# Altium schematic sheet DAC & MIC.SchDoc: Mixed Signal Design PCB
size A4; DocumentNumber: 11; Revision: A; SheetNumber: 11; SheetTotal: 11
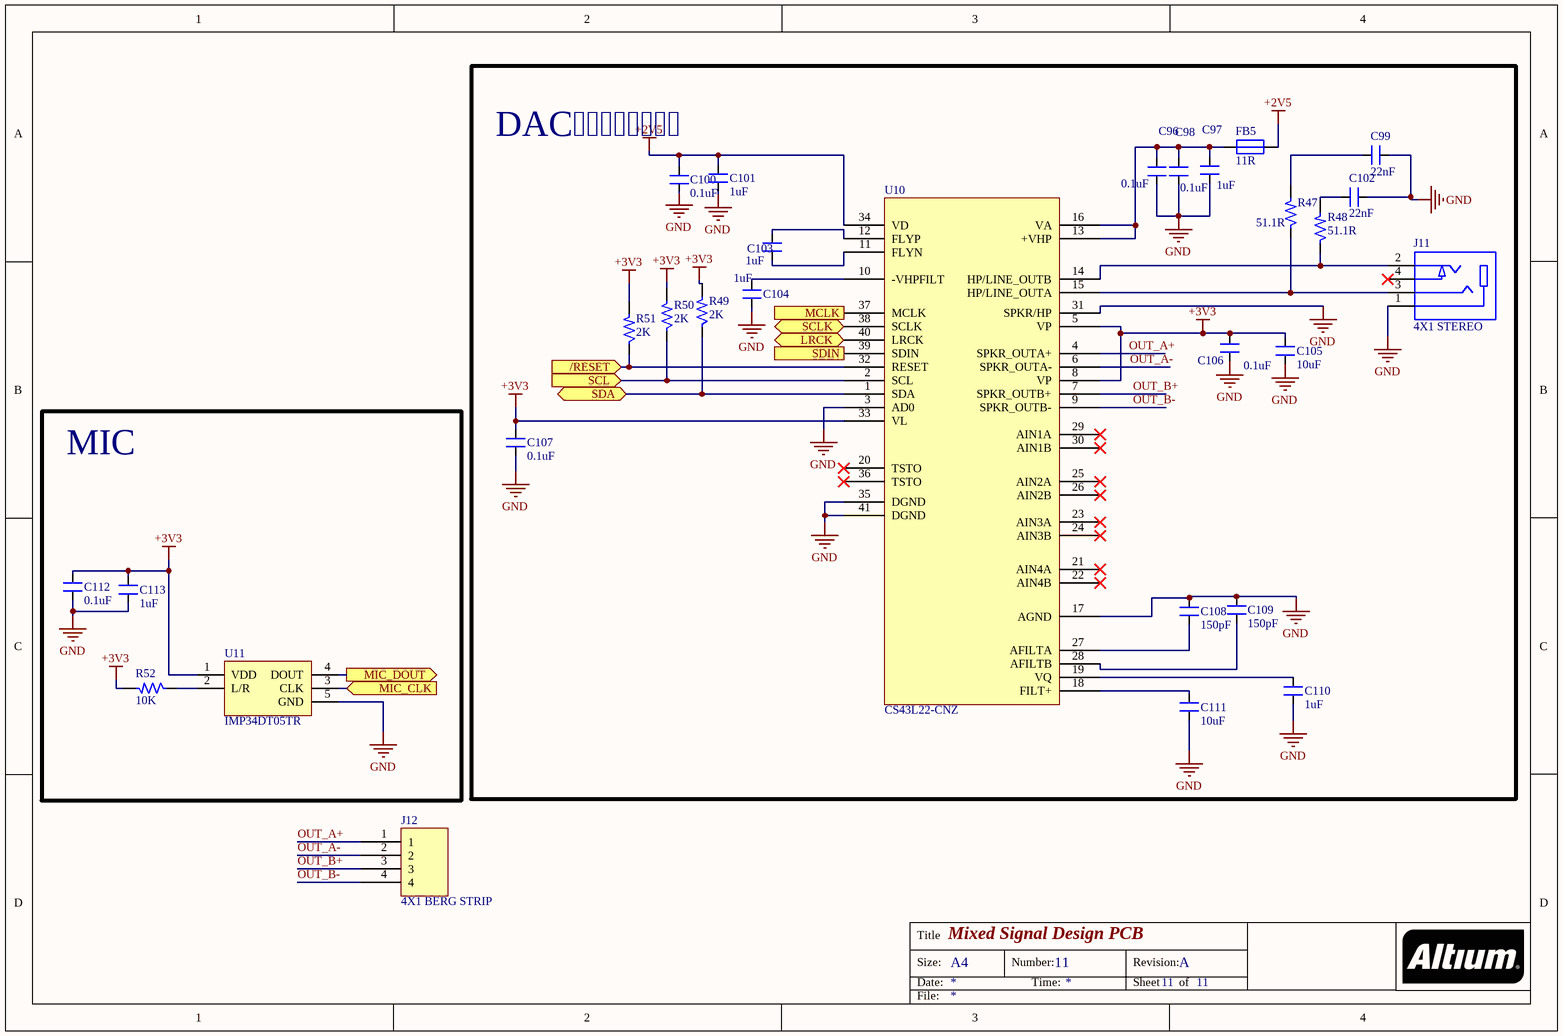
[diagram p0: DAC & MIC.SchDoc]

## Parts
C96  0.1uF  [CAP_0805]
C97  1uF  [CAP_0805]
C98  0.1uF  [CAP_0805]
C99  22nF  [CAP_0805]
C100  0.1uF  [CAP_0805]
C101  1uF  [CAP_0805]
C102  22nF  [CAP_0805]
C103  1uF  [CAP_0805]
C104  1uF  [CAP_0805]
C105  10uF  [CAP_1206]
C106  0.1uF  [CAP_0805]
C107  0.1uF  [CAP_0805]
C108  150pF  [CAP_0805]
C109  150pF  [CAP_0805]
C110  1uF  [CAP_0805]
C111  10uF  [CAP_1206]
C112  0.1uF  [CAP_0805]
C113  1uF  [CAP_0805]
FB5  11R  [IND_0805]
J11  4X1 STEREO  [CON_SJ-2504A-SMT-TR_SMD]
J12  4X1 BERG STRIP  [CON4_100_40D72_TH_ST_MALE]
R47  51.1R  [RES_0603]
R48  51.1R  [RES_0603]
R49  2K  [RES_0805]
R50  2K  [RES_0805]
R51  2K  [RES_0805]
R52  10K  [RES_0805]
U10  CS43L22-CNZ  [QFN40_19_284_33X9_SMD]
U11  IMP34DT05TR  [HCLGA-4_53_137_15X37_SMD]

## Blocks framed on the sheet
DAC: C96-C111 FB5 J11 R47-R51 U10
MIC: C112 C113 R52 U11

## Ports
/RESET (in), LRCK (bidir), MCLK (out), MIC_CLK (in), MIC_DOUT (out), SCL (in), SCLK (bidir), SDA (bidir), SDIN (in)

## Nets
+2V5: C100.1 C101.2 FB5.2 U10.34(VD)
+3V3: C105.2 C106.1 C107.1 C112.1 C113.2 R49.2 R50.2 R51.2 R52.2 U10.5(VP) U10.8(VP) U10.33(VL) U11.1(VDD)
GND: C96.2 C97.1 C98.2 C99.1 C100.2 C101.1 C102.1 C104.1 C105.1 C106.2 C107.2 C108.2 C109.2 C110.1 C111.1 C112.2 C113.1 J11.1 U10.3(AD0) U10.17(AGND) U10.31(SPKR/HP) U10.35(DGND) U10.41(DGND) U11.5(GND)
/RESET: R51.1 U10.32(RESET) ; port /RESET
LRCK: U10.40(LRCK) ; port LRCK
MCLK: U10.37(MCLK) ; port MCLK
MIC_CLK: U11.3(CLK) ; port MIC_CLK
MIC_DOUT: U11.4(DOUT) ; port MIC_DOUT
OUT_A+: J12.1 U10.4(SPKR_OUTA+)
OUT_A-: J12.2 U10.6(SPKR_OUTA-)
OUT_B+: J12.3 U10.7(SPKR_OUTB+)
OUT_B-: J12.4 U10.9(SPKR_OUTB-)
SCL: R50.1 U10.2(SCL) ; port SCL
SCLK: U10.38(SCLK) ; port SCLK
SDA: R49.1 U10.1(SDA) ; port SDA
SDIN: U10.39(SDIN) ; port SDIN
NetC96_1: C96.1 C97.2 C98.1 FB5.1 U10.13(+VHP) U10.16(VA)
NetC99_2: C99.2 R47.2
NetC102_2: C102.2 R48.2
NetC103_1: C103.1 U10.11(FLYN)
NetC103_2: C103.2 U10.12(FLYP)
NetC104_2: C104.2 U10.10(-VHPFILT)
NetC108_1: C108.1 U10.27(AFILTA)
NetC109_1: C109.1 U10.28(AFILTB)
NetC110_2: C110.2 U10.19(VQ)
NetC111_2: C111.2 U10.18(FILT+)
NetJ11_2: J11.2 R48.1 U10.14(HP/LINE_OUTB)
NetJ11_3: J11.3 R47.1 U10.15(HP/LINE_OUTA)
NetR52_1: R52.1 U11.2(L/R)

Not connected (* = marked no-connect by the designer): J11 4*; U10 20(TSTO)* 21(AIN4A)* 22(AIN4B)* 23(AIN3A)* 24(AIN3B)* 25(AIN2A)* 26(AIN2B)* 29(AIN1A)* 30(AIN1B)* 36(TSTO)*

## Notes on the sheet
- Title
- Size:
- Date:
- A4
- Number:
- Time:
- Revision:
- Sheet
- of
- File:

## Library data of the parts
C96 C98 C100 C106 C107 C112 = CAP_0.1uF-50V-5%-0805: 0.1µF ±5% 50V Ceramic Capacitor X7R 0805 (2012 Metric); Manufacturer: AVX Corporation; Manufacturer Part Number: 08055C104JAT4A; Alternate Part Number-1: 0805B104M500; Case/Package: 0805; Supplier-1: SIRICOM; Supplier Part Number-1: 0805B104J500CT
C97 C101 C103 C104 C110 C113 = CAP_1uF-50V-5%-0805: 1µF ±5% 50V Ceramic Capacitor X7R 0805 (2012 Metric); Manufacturer: Samsung; Manufacturer Part Number: CC0805JKX7R9BB105; Alternate Part Number-1: 0805F105M500NT; Case/Package: 0805; Supplier-1: SIRICOM; Supplier Part Number-1: CL21B105KBFNNNE
C99 C102 = CAP_22nF-50V-10%-0805: 0.022µF ±10% 50V Ceramic Capacitor X7R 0805 (2012 Metric); Manufacturer: Samsung Electro-Mechanics; Manufacturer Part Number: CL21B223KBANNNC; Alternate Part Number-1: NA; Case/Package: 0805; Supplier-1: Digikey; Supplier Part Number-1: 1276-1081-1-ND - Cut Tape (CT)
C105 C111 = CAP_10uF-50V-10%-1206: 10µF ±10% 50V Ceramic Capacitor X7R 1206 (3216 Metric); Manufacturer: KEMET; Manufacturer Part Number: CL31B106KBHNNNE; Alternate Part Number-1: GRT31CR61H106ME01L; Case/Package: 1206; Supplier-1: SIRICOM; Supplier Part Number-1: CC1206KKX5R9BB106
C108 C109 = CAP_150pF-50V-10%-0805: 150pF ±10% 50V Ceramic Capacitor C0G, NP0 0805 (2012 Metric); Manufacturer: AVX Corporation; Manufacturer Part Number: 08055A151KAT2A; Alternate Part Number-1: NA; Case/Package: 0805; Supplier-1: Digikey; Supplier Part Number-1: 478-10501-1-ND - Cut Tape (CT)
FB5 = FB_11R-100MHZ-1.5A-0805: 11 Ohms @ 100MHz 1 Power Line Ferrite Bead 0805 (2012 Metric) 1.5A 60mOhm; Manufacturer: Murata; Manufacturer Part Number: MI0805K110R-10; Alternate Part Number-1: NA; Case/Package: 0805; Supplier-1: SIRICOM; Supplier Part Number-1: ACMS201209A110
J11 = CON-PLG-STEREO_4X1-100-RA-SMD: 2.50mm (0.094", 3/32", Sub Mini, Miniature) - Headphone Phone Jack Stereo (4 Conductor, TRRS) Connector Solder; Manufacturer: CUI Devices; Manufacturer Part Number: SJ-2504A-SMT-TR; Alternate Part Number-1: NA; Case/Package: SMD; Supplier Part Number-1: CP-SJ-2504A-SMT-CT-ND - Cut Tape (CT); Supplier-1: Digikey
J12 = CON-BS-PLG_4X1-100-ST-TH: 4 Pins, 1 Row 2.54mm Pitch, Straight bergstrip, Male; Manufacturer: NA; Manufacturer Part Number: NA; Case/Package: TH-CON; Supplier-1: SP ROAD; Supplier Part Number-1: NA; Alternate Part Number-1: NA
R47 R48 = RES_51.1R-0.1W-1%-0603: 51.1 Ohms ±1% 0.1W, 1/10W Chip Resistor 0603 (1608 Metric) Thick Film; Manufacturer: Vishay Dale; Manufacturer Part Number: CRCW060351R1FKEAC; Alternate Part Number-1: NA; Case/Package: 0603; Supplier-1: Digikey; Supplier Part Number-1: 541-5468-1-ND - Cut Tape (CT)
R49-R51 = RES_2K-0.125W-1%-0805: 2 kOhms ±1% 0.125W, 1/8W Chip Resistor 0805 (2012 Metric) Moisture Resistant Thick Film; Manufacturer: TE Connectivity; Manufacturer Part Number: RC0805FR-072KL; Alternate Part Number-1: NA; Case/Package: 0805; Supplier-1: SIRICOM; Supplier Part Number-1: WR08X2001FTL
R52 = RES_10K-0.125W-1%-0805: 10 kOhms ±1% 0.125W, 1/8W Chip Resistor 0805 (2012 Metric) Automotive AEC-Q200 Thick Film; Manufacturer: CTS; Manufacturer Part Number: WR08X1002FTL; Case/Package: 0805; Supplier-1: SIRICOM; Supplier Part Number-1: WR08X1002FTL; Alternate Part Number-1: WR08X1002FTL
U10 = IC_CS43L22: Audio D/A Converter ICs Low Power Stereo DAC w/ClassD Spkr Driver; Manufacturer: Cirrus Logic; Alternate Part Number-1: NA; Manufacturer Part Number: CS43L22-CNZ; Case/Package: QFN-40; Supplier-1: Mouser; Supplier Part Number-1: 777-CS43L22-CNZ
U11 = IC_IMP34DT05TR: MEMS Microphones AUTO & INDUSTRIAL SENSORS; Manufacturer: STMicroelectronics; Alternate Part Number-1: NA; Manufacturer Part Number: IMP34DT05TR; Case/Package: HCLGA-4; Supplier-1: Mouser; Supplier Part Number-1: 511-IMP34DT05TR